# EAGLE design 717_PositionConversionBoard (EAGLE 9.6.2)
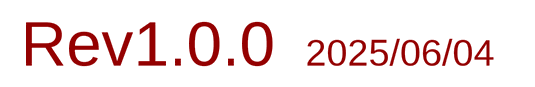
[diagram p0: schematic, sheet 1, part 1 of 3]
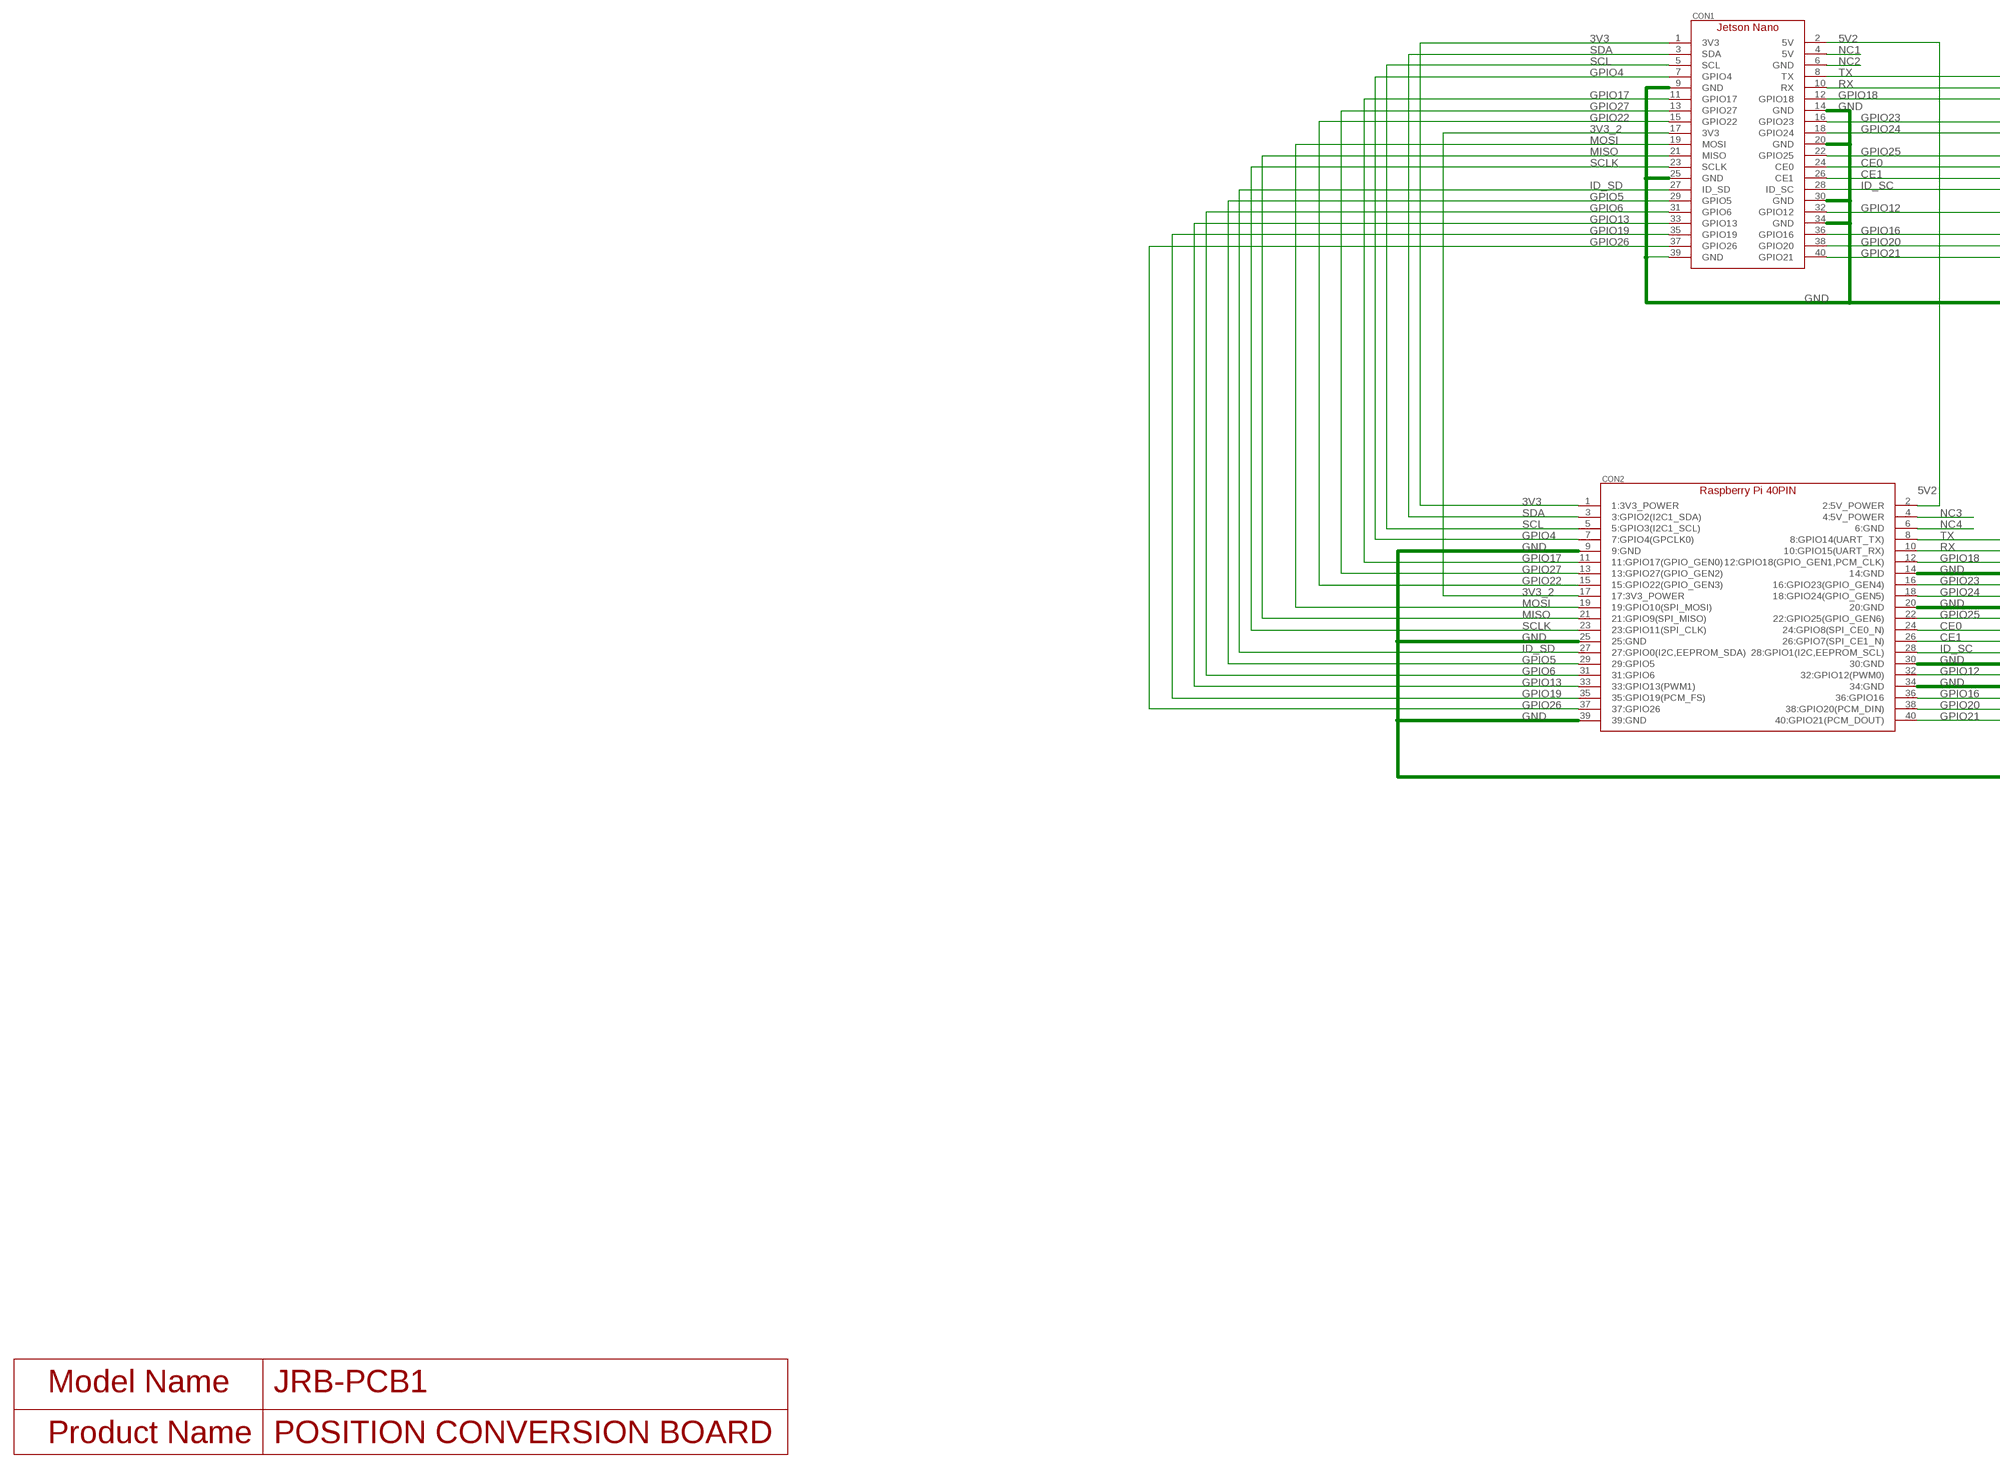
[diagram p1: schematic, sheet 1, part 2 of 3]
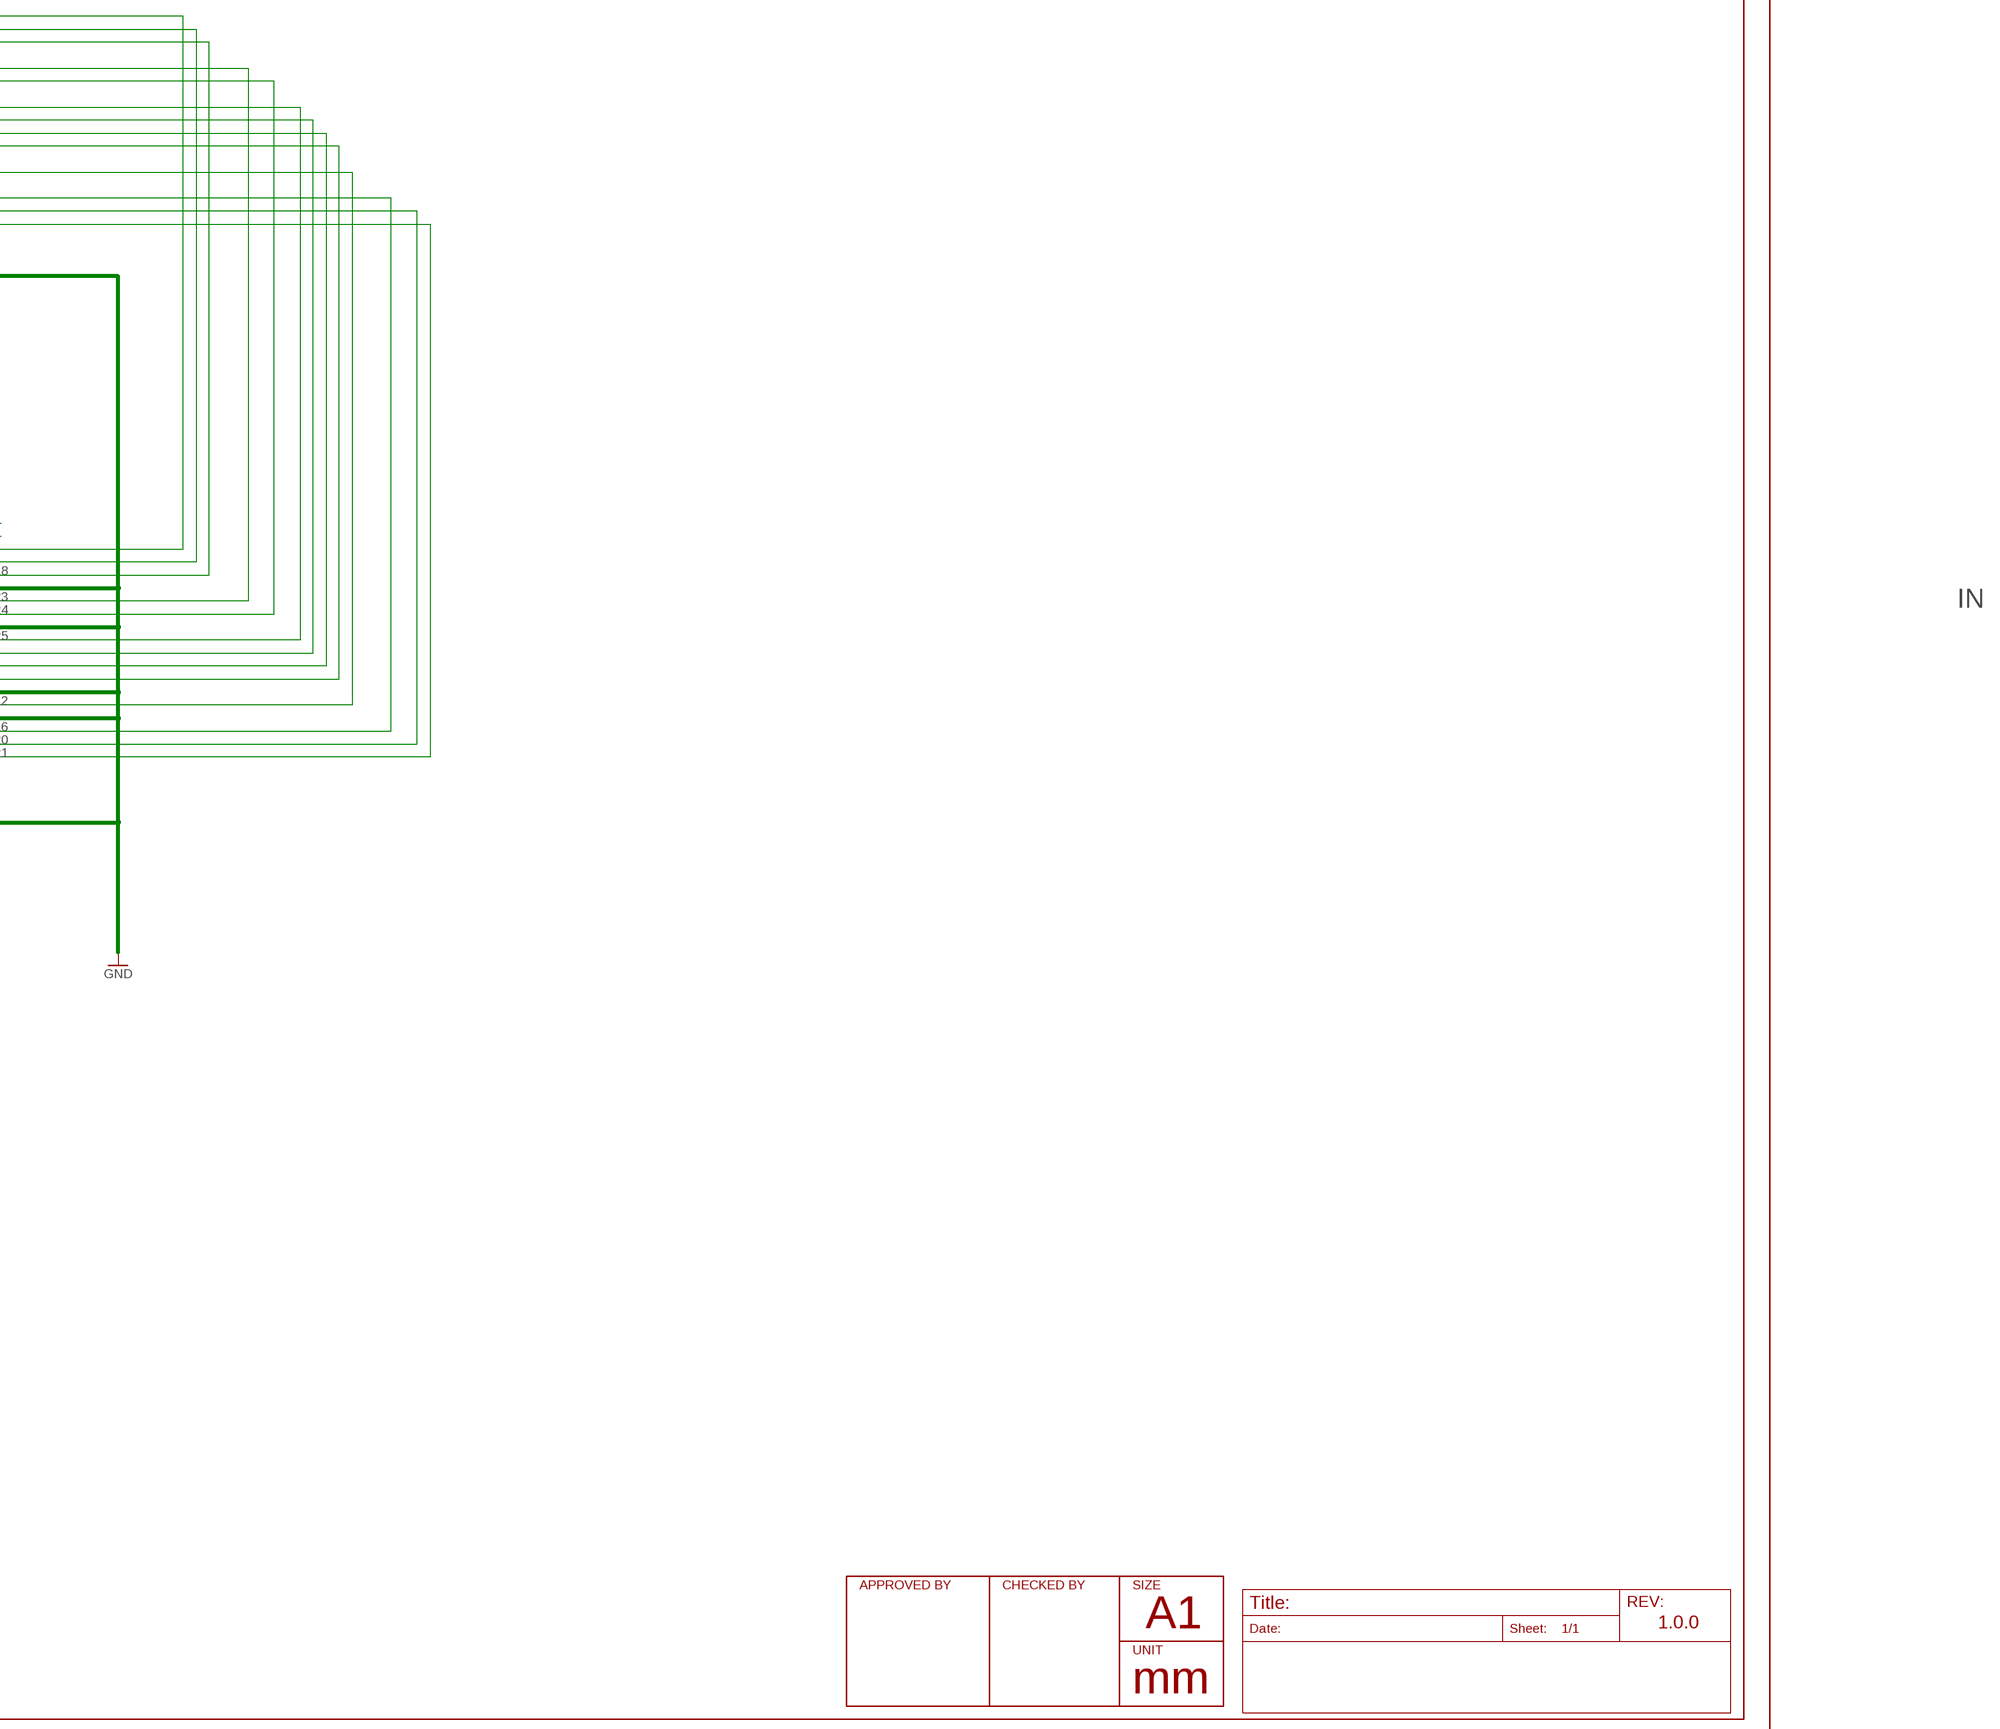
[diagram p2: schematic, sheet 1, part 3 of 3]

## Parts
CON1  JETSON_NANOJETSON_ORIN_NANO  [JETSON_ORIN_NANO_DIMENTION]
CON2  RASPBERRYPI_SHEILDUPPERBOARD  [RASPBERRY_PI_SHILED_NONDEMETION]

## Nets
3V3: CON1.1(3V3) CON2.1(1:3V3_POWER)
3V3_2: CON1.17(3V3) CON2.17(17:3V3_POWER)
5V2: CON1.2(5V) CON2.2(2:5V_POWER)
CE0: CON1.24(CE0) CON2.24(24:GPIO8(SPI_CE0_N))
CE1: CON1.26(CE1) CON2.26(26:GPIO7(SPI_CE1_N))
GND: CON1.9(GND) CON1.14(GND) CON1.20(GND) CON1.25(GND) CON1.30(GND) CON1.34(GND) CON1.39(GND) CON2.9(9:GND) CON2.14(14:GND) CON2.20(20:GND) CON2.25(25:GND) CON2.30(30:GND) CON2.34(34:GND) CON2.39(39:GND)
GPIO4: CON1.7(GPIO4) CON2.7(7:GPIO4(GPCLK0))
GPIO5: CON1.29(GPIO5) CON2.29(29:GPIO5)
GPIO6: CON1.31(GPIO6) CON2.31(31:GPIO6)
GPIO12: CON1.32(GPIO12) CON2.32(32:GPIO12(PWM0))
GPIO13: CON1.33(GPIO13) CON2.33(33:GPIO13(PWM1))
GPIO16: CON1.36(GPIO16) CON2.36(36:GPIO16)
GPIO17: CON1.11(GPIO17) CON2.11(11:GPIO17(GPIO_GEN0))
GPIO18: CON1.12(GPIO18) CON2.12(12:GPIO18(GPIO_GEN1,PCM_CLK))
GPIO19: CON1.35(GPIO19) CON2.35(35:GPIO19(PCM_FS))
GPIO20: CON1.38(GPIO20) CON2.38(38:GPIO20(PCM_DIN))
GPIO21: CON1.40(GPIO21) CON2.40(40:GPIO21(PCM_DOUT))
GPIO22: CON1.15(GPIO22) CON2.15(15:GPIO22(GPIO_GEN3))
GPIO23: CON1.16(GPIO23) CON2.16(16:GPIO23(GPIO_GEN4))
GPIO24: CON1.18(GPIO24) CON2.18(18:GPIO24(GPIO_GEN5))
GPIO25: CON1.22(GPIO25) CON2.22(22:GPIO25(GPIO_GEN6))
GPIO26: CON1.37(GPIO26) CON2.37(37:GPIO26)
GPIO27: CON1.13(GPIO27) CON2.13(13:GPIO27(GPIO_GEN2))
ID_SC: CON1.28(ID_SC) CON2.28(28:GPIO1(I2C,EEPROM_SCL))
ID_SD: CON1.27(ID_SD) CON2.27(27:GPIO0(I2C,EEPROM_SDA))
MISO: CON1.21(MISO) CON2.21(21:GPIO9(SPI_MISO))
MOSI: CON1.19(MOSI) CON2.19(19:GPIO10(SPI_MOSI))
NC1: CON1.4(5V)
NC2: CON1.6(GND)
NC3: CON2.4(4:5V_POWER)
NC4: CON2.6(6:GND)
RX: CON1.10(RX) CON2.10(10:GPIO15(UART_RX))
SCL: CON1.5(SCL) CON2.5(5:GPIO3(I2C1_SCL))
SCLK: CON1.23(SCLK) CON2.23(23:GPIO11(SPI_CLK))
SDA: CON1.3(SDA) CON2.3(3:GPIO2(I2C1_SDA))
TX: CON1.8(TX) CON2.8(8:GPIO14(UART_TX))

## Notes on the sheet
- Rev1.0.0 | 2025/06/04
- IN
- Model Name | JRB-PCB1
- Product Name | POSITION CONVERSION BOARD
- 1.0.0

## Library data of the parts
CON1 = FaBo-Boards:JETSON_NANO
CON2 = FaBo-Boards:RASPBERRYPI_SHEILD

## Board
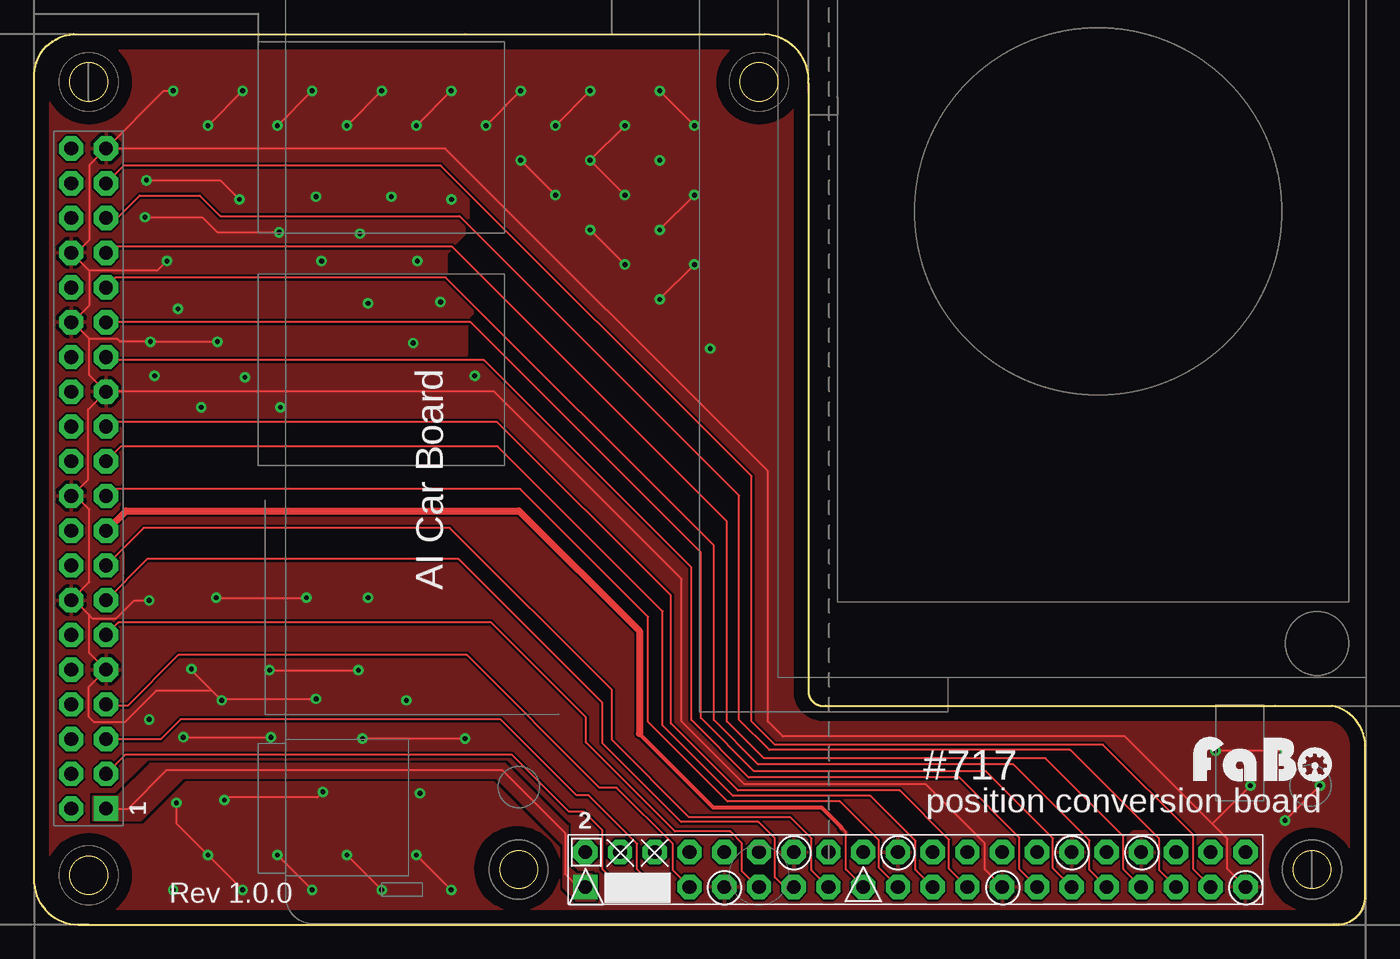
[diagram p3: board, top side]
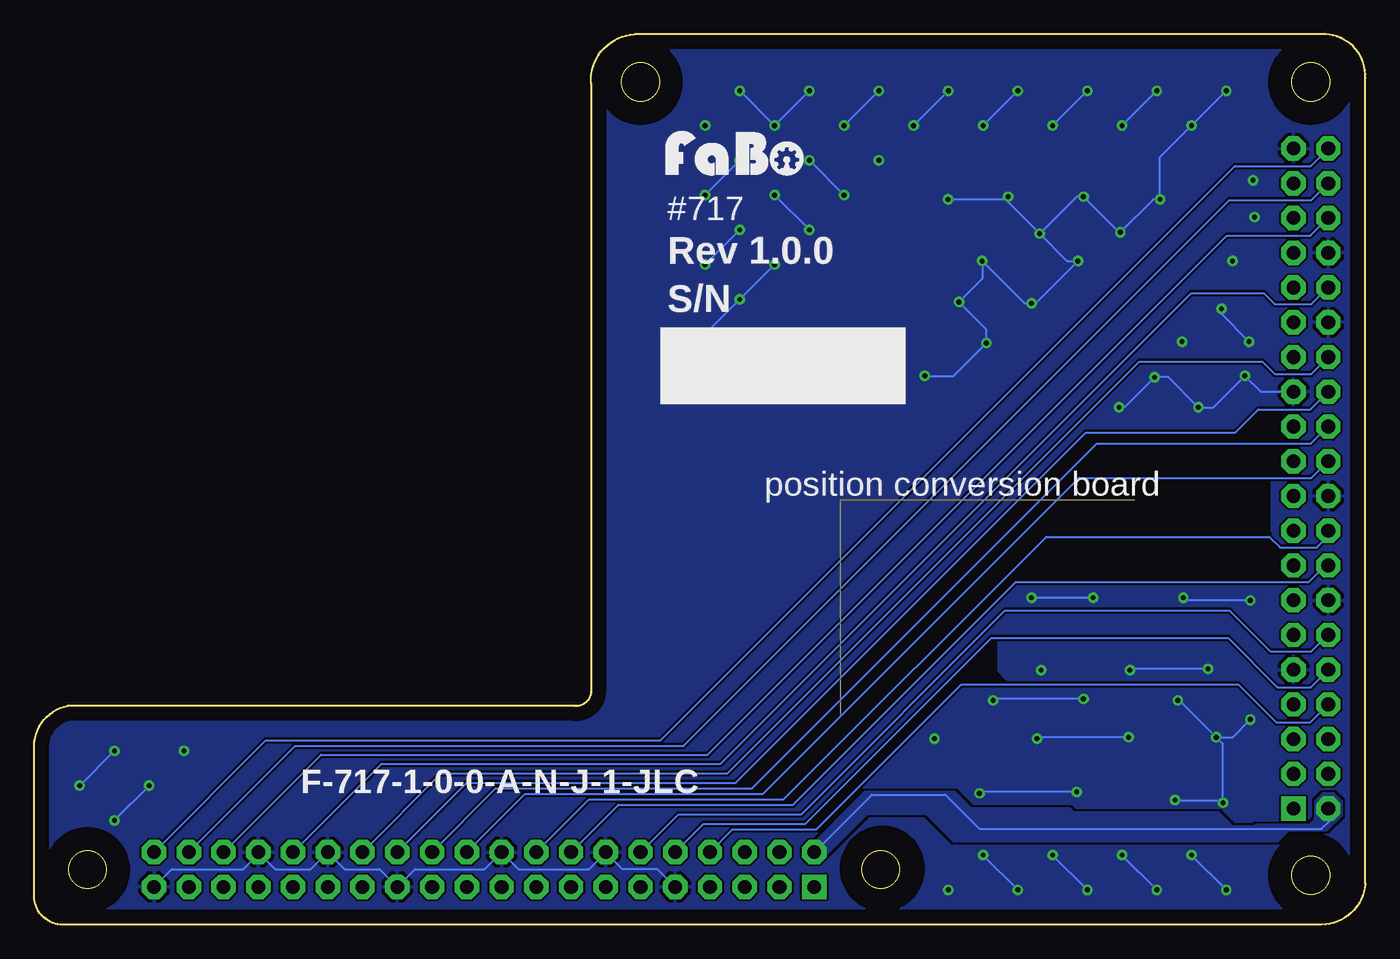
[diagram p4: board, bottom side, seen from below]

Size 97.3 x 65.11 mm. Coordinates in mm from the lower left corner, seen from the top.
Outline: 95,0.01 arc90 97.3,1.91 97.3,13.1 arc78 94.85,16.01 57.85,16.01 arc-97 56.6,17.01 56.6,61.51 arc90 53.4,65.11 2.9,65.11 arc90 0,61.91 0,3.01 arc85 3.2,0.01 95,0.01
Copper layers (1*16): Top 0.035mm / dielectric 1.5mm / Bottom 0.035mm
Design rules "default *": minimum track width 6mil, minimum drill 0.35mm, track to track 6mil, track to pad 6mil, pad to pad 6mil, via to via 6mil, smd to smd 6mil, copper to edge 40mil, drill to drill 6mil, minimum pad ring 10mil, minimum via ring 8mil, stop-mask expansion 4mil, vias tented up to drill 0.4mm, thermal gap 10mil
tRestrict: area 0.9,58.5 to 7.1,64.7; area 0.9,0.5 to 7.1,6.7; area 49.9,58.5 to 56.1,64.7; area 32.2,1 to 38.4,7.2; area 90.3,0.9 to 96.5,7.1; 22 lines
bRestrict: area 0.9,58.5 to 7.1,64.7; area 0.9,0.5 to 7.1,6.7; area 49.9,58.5 to 56.1,64.7; area 32.2,1 to 38.4,7.2; area 90.3,0.9 to 96.5,7.1; 4 lines

### Footprints (pad centres in the part's own frame; a part is rotated, then mirrored left to right if it is on the bottom)
JETSON_ORIN_NANO_DIMENTION = drill 1 pad 1.778 square: 1 21.9,2.7 | drill 1 pad 1.778 octagon: 2 21.9,5.24; 3 24.44,2.7; 4 24.44,5.24; 5 26.98,2.7; 6 26.98,5.24; 7 29.52,2.7; 8 29.52,5.24; 9 32.06,2.7; 10 32.06,5.24; 11 34.6,2.7; 12 34.6,5.24; 13 37.14,2.7; 14 37.14,5.24; 15 39.68,2.7; 16 39.68,5.24; 17 42.22,2.7; 18 42.22,5.24; 19 44.76,2.7; 20 44.76,5.24; 21 47.3,2.7; 22 47.3,5.24; 23 49.84,2.7; 24 49.84,5.24; 25 52.38,2.7; 26 52.38,5.24; 27 54.92,2.7; 28 54.92,5.24; 29 57.46,2.7; 30 57.46,5.24; 31 60,2.7; 32 60,5.24; 33 62.54,2.7; 34 62.54,5.24; 35 65.08,2.7; 36 65.08,5.24; 37 67.62,2.7; 38 67.62,5.24; 39 70.16,2.7; 40 70.16,5.24
RASPBERRY_PI_SHILED_NONDEMETION = drill 1 pad 1.778 square: 1 -24.13,-1.27 | drill 1 pad 1.778 octagon: 2 -24.13,1.27; 3 -21.59,-1.27; 4 -21.59,1.27; 5 -19.05,-1.27; 6 -19.05,1.27; 7 -16.51,-1.27; 8 -16.51,1.27; 9 -13.97,-1.27; 10 -13.97,1.27; 11 -11.43,-1.27; 12 -11.43,1.27; 13 -8.89,-1.27; 14 -8.89,1.27; 15 -6.35,-1.27; 16 -6.35,1.27; 17 -3.81,-1.27; 18 -3.81,1.27; 19 -1.27,-1.27; 20 -1.27,1.27; 21 1.27,-1.27; 22 1.27,1.27; 23 3.81,-1.27; 24 3.81,1.27; 25 6.35,-1.27; 26 6.35,1.27; 27 8.89,-1.27; 28 8.89,1.27; 29 11.43,-1.27; 30 11.43,1.27; 31 13.97,-1.27; 32 13.97,1.27; 33 16.51,-1.27; 34 16.51,1.27; 35 19.05,-1.27; 36 19.05,1.27; 37 21.59,-1.27; 38 21.59,1.27; 39 24.13,-1.27; 40 24.13,1.27

### Placement (x,y rotation side)
CON1  18.38,0.07 0 top
CON2  3.98,32.62 90 top
U$3  [LOGO_FABO_M]  89.8,10.11 0 top
U$5  [LOGO_FABO_M]  46.1,54.41 0 bottom

### Tracks (layer width: path | path; a pad name or v marks a point on that pad's centre or on a via)
3V3
  Top 0.152: CON2.1 6.88,8.49 9.7,11.31 34.2,11.31 38.8,6.71 38.8,3.71 39.74,2.77 CON1.1
  pour Top (no thermals): 4.3,7.61 4.3,9.41 6.1,9.41 8.5,11.81 34.4,11.81 39,7.21 39,4.31 39.6,3.71 40.7,3.71 41,3.41 41,1.81 40.9,1.71 39.7,1.71 38.7,2.71 38.7,5.81 33.8,10.71 10.9,10.71 7.8,7.61
3V3_2
  Top 0.152: CON1.17 59.33,4.04 59.33,6.77 59.03,7.07
  Top 0.305: 44.23,13.97 49.63,8.57 57.53,8.57 59.03,7.07
  Top 0.508: CON2.17 6.71,30.27 35.43,30.27 44.23,21.47 44.23,13.97
  pour Top (no thermals): 58.85,7.06 59,7.21 59.4,6.81 59.4,6.51
5V2
  Bottom 0.152: CON1.2 36.08,9.51 30.7,9.51 28.2,7.01 3.2,7.01 2.6,7.61 2.6,8.38 CON2.2
  pour Bottom (no thermals): 1.7,8.01 1.7,9.01 2.3,9.61 3.1,9.61 3.7,9.01 3.7,7.71 4.1,7.31 8,7.31 8.1,7.21 9.7,7.21 10.7,8.21 21.3,8.21 21.6,8.51 28.8,8.51 30,9.71 36.6,9.71 41,5.31 41,4.91 40.8,4.71 39.8,4.71 36.4,8.11 32.1,8.11 30.1,6.11 6.4,6.11 5.6,6.91 2.8,6.91
CE0
  Bottom 0.152: CON1.24 63.56,9.97 44.83,9.97 19.63,35.17 3.97,35.17 CON2.24
CE1
  Bottom 0.152: CON1.26 65.7,10.37 46.03,10.37 20.43,35.97 9.51,35.97 7.81,37.67 4.01,37.67 CON2.26
GND  (via drill 0.35)
  Top 0.152: CON1.25 69.48,4.05 69.48,5.97 65.18,10.27 51.93,10.27 47.33,14.87 47.33,25.27 33.63,38.97 CON2.25 | CON1.39 87.23,4.08 87.23,6.27 86.12,7.38 | 86.12,7.38 79.73,13.77 54.73,13.77 53.63,14.87 53.63,33.17 30.05,56.75 CON2.39 | CON2.39 4.03,55.53 4.03,50.07 3.09,49.13 CON2.34 4.03,47.81 | 4.03,47.81 4.03,45.27 2.81,44.05 | 2.81,44.05 CON2.30 | CON2.25 4.03,40.19 4.03,42.81 | 4.03,42.81 4.03,42.87 2.85,44.05 2.81,44.05 | CON2.20 2.78,31.42 | 2.78,31.42 3.93,32.57 3.93,37.67 5.23,38.97 CON2.25 | 2.78,31.42 2.98,31.42 4.03,30.37 4.03,25.05 CON2.14 2.97,23.73 4.03,22.67 4.03,22.61 | 4.03,22.61 4.03,19.87 CON2.9 4,17.4 4,15.21 4.4,14.81 6.6,14.81 8.9,17.11 13,17.11 v13.7,16.41 | CON2.39 9.47,60.97 v10.16,60.97 | v12.7,58.43 v15.24,60.97 | v17.78,58.43 v20.32,60.97 | v22.86,58.43 v25.4,60.97 | v27.94,58.43 v30.48,60.97 | v33.02,58.43 v35.56,60.97 | v38.1,58.43 v40.64,60.97 | v43.18,58.43 v40.64,55.89 v43.18,53.35 | v38.1,53.35 v35.56,55.89 | v45.72,60.97 v48.26,58.43 | v30.48,2.55 v27.94,5.09 | v25.4,2.55 v22.86,5.09 | v20.32,2.55 v17.78,5.09 | v15.24,2.55 v12.7,5.09 10.4,7.39 v10.4,8.91 | v40.64,50.81 v43.18,48.27 | v45.72,45.73 v48.26,48.27 | v45.72,50.81 v48.26,53.35 | 86.12,7.38 v88.9,10.17 | v91.44,7.63 v93.98,10.17 | v91.44,12.71 v86.36,12.71 | v13.9,9.11 14.1,9.31 20.7,9.31 v21.1,9.71 | v10.9,13.71 v17.3,13.71 | v24,13.61 v31.5,13.61 | v13.7,16.41 13.8,16.51 v20.6,16.51 | v13.7,16.41 11.5,18.61 v11.5,18.71 | v17.2,18.61 v23.7,18.61 | 4.03,22.61 4.23,22.41 6,22.41 7.3,23.71 v8.4,23.71 | v13.3,23.91 v19.9,23.91 | v9.7,48.53 8.98,47.81 4.03,47.81 | 4.03,42.81 6.1,42.81 6.28,42.63 v8.5,42.63 v13.4,42.63 | v8.1,51.73 12.28,51.73 13.38,50.63 v17.9,50.63
  Top 0.152: v8.2,54.43 13.6,54.43 v15,53.03
  Bottom 0.152: CON1.9 51.74,4.07 54.28,4.07 CON1.14 56.76,4.07 61.9,4.07 CON1.20 64.38,4.07 69.46,4.07 CON1.25 72.06,4.07 74.6,4.07 CON1.30 77.08,4.07 79.68,4.07 CON1.34 80.92,5.18 82.03,4.07 87.24,4.07 CON1.39 | v10.16,60.97 v12.7,58.43 15,56.13 v15,53.03 15.5,53.03 v17.9,50.63 18,50.63 v20.6,53.23 21.1,53.23 v23.8,50.53 | v15.24,60.97 v17.78,58.43 | v20.32,60.97 v22.86,58.43 | v25.4,60.97 v27.94,58.43 | v30.48,60.97 v33.02,58.43 | v35.56,60.97 v38.1,58.43 | v40.64,60.97 v43.18,58.43 v45.72,60.97 | v40.64,55.89 v38.1,53.35 | v27.94,5.09 v25.4,2.55 | v22.86,5.09 v20.32,2.55 | v17.78,5.09 v15.24,2.55 | v12.7,5.09 v10.16,2.55 | v43.18,53.35 v40.64,50.81 | v43.18,48.27 v45.72,45.73 49.32,42.13 v49.42,42.13 | v48.26,48.27 v45.72,50.81 | v48.26,53.35 v45.72,55.89 | v88.9,10.17 v91.44,7.63 | v93.98,10.17 v91.44,12.71 | v13.9,9.11 10.6,9.11 v10.4,8.91 10.4,13.21 v10.9,13.71 | v17.3,13.71 23.9,13.71 v24,13.61 | v21.1,9.71 28.1,9.71 v28.2,9.61 | v10.9,13.71 13.6,16.41 v13.7,16.41 | v20.6,16.51 27.1,16.51 v27.2,16.41 | v11.5,18.71 17.1,18.71 v17.2,18.61 | v8.4,23.71 13.1,23.71 v13.3,23.91 | v19.9,23.91 v24.4,23.91 | v10.5,45.03 10.5,44.63 v8.5,42.63 | v23.8,50.53 21.8,48.53 v21,48.53 24.1,45.43 v24.4,45.43 24.9,45.43 v28,48.53 28,47.23 v29.7,45.53 27.7,43.53 v27.7,42.53 30.1,40.13 v32.2,40.13 | v23.8,50.53 26.1,52.83 v26.1,53.23 26.3,53.03 v30.5,53.03 | v18,37.83 17.6,37.83 v15.4,40.03 14.4,40.03 v12.2,37.83 11.1,37.83 v8.8,40.13 7.64,38.97 CON2.25 | v10.9,13.71 9.7,13.71 v8.4,15.01
  pour Bottom (rank 6): -1.8,70.59 99.3,70.59 99.3,-17.39 -1.8,-17.39
  pour Top (rank 6): -4,72.5 100.9,72.5 100.9,-18.79 -4,-18.79
GPIO4
  Top 0.152: CON1.7 46.68,3.99 46.68,5.92 42.58,10.02 41.33,10.02 31.63,19.72 10.53,19.72 6.83,16.02 5.34,16.02 CON2.7
GPIO5
  Top 0.152: CON1.29 74.48,4.13 74.48,6.32 69.58,11.22 52.63,11.22 48.73,15.12 48.73,27.22 31.9,44.05 CON2.29
GPIO6
  Top 0.152: CON1.31 77.13,4.02 77.13,6.17 71.57,11.73 52.92,11.73 49.68,14.97 49.68,27.72 30.08,47.32 5.93,47.32 5.25,46.64 CON2.31
GPIO12
  Bottom 0.152: CON1.32 71.92,11.77 47.13,11.77 12.73,46.17 7.43,46.17 6.63,45.37 3.93,45.37 CON2.32
GPIO13
  Top 0.152: CON1.33 79.63,4.06 79.63,6.47 73.93,12.17 53.33,12.17 50.63,14.87 50.63,29.47 30.53,49.57 5.69,49.57 CON2.33
GPIO16
  Bottom 0.152: CON1.36 76.34,12.43 48.07,12.43 10.13,50.37 4.01,50.37 CON2.36
GPIO17
  Top 0.152: CON2.11 6.15,22.09 33.41,22.09 40.33,15.17 40.33,13.32 46.83,6.82 50.88,6.82 51.73,5.97 51.73,3.92 52.88,2.77 CON1.11
GPIO18
  Bottom 0.152: CON2.12 3.93,19.97 6.93,19.97 9.93,22.97 26.33,22.97 41.23,8.07 50.22,8.07 CON1.12
GPIO19
  Top 0.152: CON1.35 82.23,4 82.23,6.27 75.73,12.77 53.73,12.77 51.53,14.97 51.53,31.37 31.25,51.65 31.23,51.67 31.09,51.81 13.6,51.81 12.1,53.31 7.7,53.31 6.06,51.67 CON2.35
GPIO20
  Bottom 0.152: CON1.38 78.24,13.07 49.83,13.07 9.93,52.97 3.95,52.97 CON2.38
GPIO21
  Bottom 0.152: CON1.40 80.38,13.47 51.53,13.47 9.53,55.47 3.99,55.47 CON2.40
GPIO22
  Top 0.152: CON2.15 8,29.02 30.38,29.02 42.23,17.17 42.23,13.52 47.88,7.87 55.28,7.87 56.83,6.32 56.83,4 CON1.15
GPIO23
  Bottom 0.152: CON1.16 54.6,8.77 41.83,8.77 25.55,25.05 4.13,25.05 2.91,26.27 CON2.16
GPIO24
  Bottom 0.152: CON1.18 56.74,9.17 42.53,9.17 23.33,28.37 7.03,28.37 6.23,27.57 3.53,27.57 2.71,28.39 CON2.18
GPIO25
  Bottom 0.152: CON1.22 61.42,9.57 44.03,9.57 20.93,32.67 3.93,32.67 CON2.22
GPIO26
  Top 0.152: CON1.37 84.73,4.04 84.73,6.57 78.13,13.17 54.13,13.17 52.44,14.86 52.44,32.8 29.72,55.51 6.55,55.51 CON2.37
GPIO27
  Top 0.152: CON1.13 54.83,2.77 54.13,3.47 54.13,6.32 52.93,7.52 47.28,7.52 41.53,13.27 41.53,16.22 31.02,26.73 8.25,26.73 CON2.13
ID_SC
  Bottom 0.152: CON1.28 67.54,11.07 46.63,11.07 16.53,41.17 7.53,41.17 6.63,40.27 3.95,40.27 CON2.28
ID_SD
  Top 0.152: CON1.27 72.03,4.04 72.03,6.37 67.63,10.77 52.23,10.77 48.03,14.97 48.03,26.12 32.88,41.27 5.49,41.27 CON2.27
MISO
  Top 0.152: CON1.21 64.43,4.02 64.43,6.12 61.13,9.42 51.08,9.42 45.93,14.57 45.93,22.92 33.88,34.97 6.33,34.97 CON2.21
MOSI
  Top 0.152: CON1.19 61.73,4.18 61.73,6.17 58.88,9.02 50.68,9.02 44.88,14.82 44.88,22.51 35.52,31.87 5.77,31.87 CON2.19
RX
  Bottom 0.152: CON2.10 3.99,17.37 6.43,17.37 10.03,20.97 27.33,20.97 40.93,7.37 48.38,7.37 CON1.10
SCL
  Top 0.152: CON1.5 44.08,4.05 44.08,5.92 40.53,9.47 39.63,9.47 34.08,15.02 10.7,15.02 9.25,13.57 CON2.5
SCLK
  Top 0.152: CON1.23 66.88,4.11 66.88,6.22 63.28,9.82 51.43,9.82 46.53,14.72 46.53,24.07 33.83,36.77 5.59,36.77 CON2.23
SDA
  Top 0.152: CON1.3 41.53,4.06 41.53,6.92 40.18,8.27 39.08,8.27 34.92,12.43 6.65,12.43 CON2.3
TX
  Bottom 0.152: CON2.8 4.01,14.81 6.51,14.81 9.27,17.57 29.53,17.57 40.13,6.97 46.24,6.97 CON1.8

### Text on the board
tPlace: AI Car Board | #717 | 1 | position conversion board | 2 | Rev 1.0.0
bPlace: #717 | Rev 1.0.0 | S/N | position conversion board | F-717-1-0-0-A-N-J-1-JLC
Document: #717 GPIO40Pin position conversion board / Revision 1.0.0 / 2025/06/04